# Altium schematic sheet PWR_LMQ66430.SchDoc
size A3; SheetNumber: 21; SheetTotal: 22
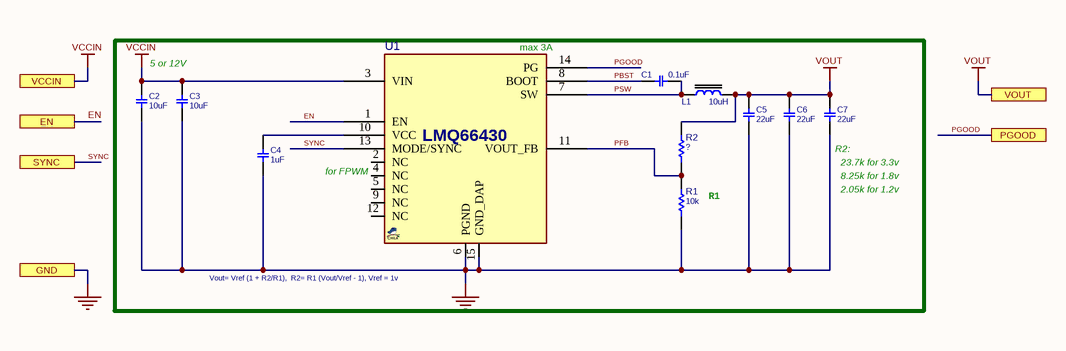
[diagram p0: PWR_LMQ66430.SchDoc]

## Parts
C1  0.1uF  [C0402A]
C2  10uF  [C0805]
C3  10uF  [C0805]
C4  1uF  [C0402A]
C5  22uF  [C0805A]
C6  22uF  [C0805A]
C7  22uF  [C0805A]
L1  10uH  [L_7]
R1  10k  [R0402A]
R2  ?  [R0402A]
U1  LMQ66430  [QFN50_15_RXB]  (value not drawn)

## Ports
EN, GND, PGOOD, SYNC, VCCIN, VOUT

## Nets
GND: C2.1 C3.1 C4.1 C5.2 C6.2 C7.2 R1.2 U1.6(PGND) U1.15(GND_DAP) ; port GND
VCCIN: C2.2 C3.2 U1.3(VIN) ; port VCCIN
VOUT: C5.1 C6.1 C7.1 L1.2 R2.1 ; port VOUT
EN: U1.1(EN) ; port EN
PBST: C1.1 U1.8(BOOT)
PFB: R1.1 R2.2 U1.11(VOUT_FB)
PGOOD: U1.14(PG) ; port PGOOD
PSW: C1.2 L1.1 U1.7(SW)
SYNC: U1.13(MODE/SYNC) ; port SYNC
NetC4_2: C4.2 U1.10(VCC)

Not connected (* = marked no-connect by the designer): U1 2(NC) 4(NC) 5(NC) 9(NC) 12(NC)

## Notes on the sheet
- 5 or 12V
- (near U1) max 3A
- (near U1) for FPWM
- R1
- (near C7) R2:
- (near C7) 23.7k for 3.3v
- 8.25k for 1.8v
- 2.05k for 1.2v
- (near U1) Vout= Vref (1 + R2/R1),  R2= R1 (Vout/Vref - 1), Vref = 1v

## Library data of the parts
C1 = CAP_SMD_MLCC_100n50V: CAP, MLCC; PARAM: X5R, 10%; PARAM2: 25v; MANF: -; DESC: -; ASSEMBLY: ASSEMBLY; PRICE: -; VALUE: 0.1uF; MANF_P#: -
C2 C3 = CAP_SMD_MLCC: CAP, MLCC; PARAM: X5R, 20%; MANF_P#: CL21A106KAYNNNE; MANF: Samsung; PARAM2: 25v; PRICE: 10,000: $0.034; ASSEMBLY: ASSEMBLY; VALUE: 10uF
C4 = CAP_SMD_MLCC: CAP, MLCC; PARAM: X5R, 20%; MANF: Samsung; PARAM2: 6.3v; PRICE: 10,000:	$0.013; MANF_P#: -; ASSEMBLY: ASSEMBLY; VALUE: 1uF
C5-C7 = CAP_SMD_MLCC_47u25V: CAP, MLCC; PARAM: 6.3v; MANF: Samsung; PARAM2: X5R, 20%; DESC: CAP, MLCC, X5R 47uF 25V 20% 1206; MANF_P#: CL21A476MQYNNNE; PRICE: 500= 265$; VALUE: 22uF
L1 = IND_SMD_2.2uH_4A: INDUCTOR; PARAM: 4A (Irms); MANF: KYOCERA AVX; PARAM2: 68mOhm; MANF_P#: LMLP07A7M100DTAS; PRICE: 0.25$; DESC: -; ASSEMBLY: ASSEMBLY; VALUE: 10uH
R1 R2 = RES_SMD: RESISTOR, SMD, 20K, 0402; PARAM: 0.063W; DIST#: MOUSER; PARAM2: 1%; MANF: -; ASSEMBLY: ASSEMBLY; PRICE: 100= 0.5$; DESC: RESISTOR, SMD, 20K, 0402; MANF_P#: -
  R1: VALUE: 10k
  R2: VALUE: ?
U1 = VREG_LMQ66430MC3_QFN15: REG, Switching, Buck, 3.6~36Vin, 3A, RXB-15; MANF: Texas Instruments; PARAM: 3A, 2MHz; PARAM2: 3.6~36VIN,1~18Vout; MANF_P#: LMQ66430MC3RXBRQ1; PRICE: 4$; ASSEMBLY: ASSEMBLY; VALUE: LMQ66430; PACKAGE: QFN-15 RXB